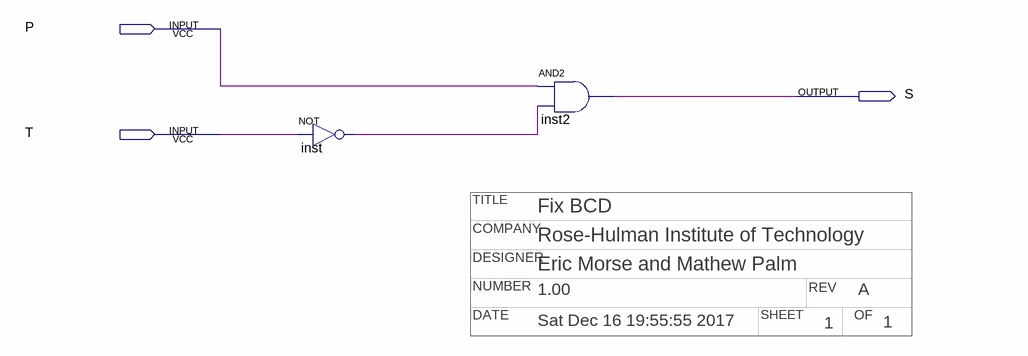
[diagram p0: schematic sheet]
// Quartus schematic fix_bcd.bdf as structural Verilog: 2 symbols, 3 pins
// Title block: COMPANY: Rose-Hulman Institute of Technology; DATE: Sat Dec 16 19:55:55 2017; DESIGNER: Eric Morse and Mathew Palm; NUMBER: 1.00; OF: 1; REV: A; SHEET: 1; TITLE: Fix BCD
module fix_bcd (
  input  P,
  input  T,
  output S
);

  wire inst_out;

  not inst (inst_out, T);
  and inst2 (S, P, inst_out);
endmodule
